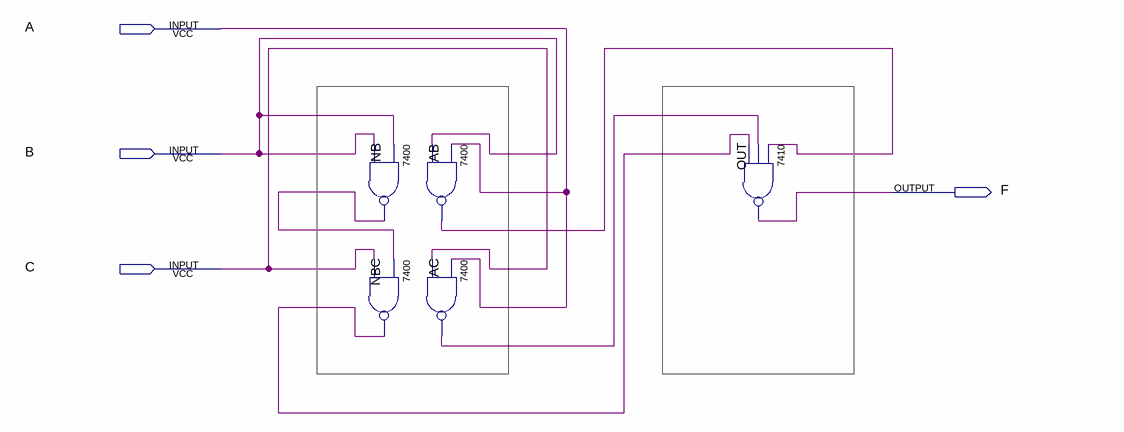
[diagram p0: schematic sheet]
// Quartus schematic ece385lab1.bdf as structural Verilog: 5 symbols, 4 pins
module ece385lab1 (
  input  A,
  input  B,
  input  C,
  output F
);

  wire AB_1, AC_1, NB_1, NBC_1;

  \7400  NB (.\3 (B), .\2 (B), .\1 (NB_1));
  \7400  AB (.\3 (B), .\2 (A), .\1 (AB_1));
  \7400  NBC (.\3 (C), .\2 (NB_1), .\1 (NBC_1));
  \7400  AC (.\3 (C), .\2 (A), .\1 (AC_1));
  \7410  OUT (.\2 (AB_1), .\3 (AC_1), .\4 (NBC_1), .\1 (F));
endmodule
